# EAGLE design SerialOLED (EAGLE 7.2.0)
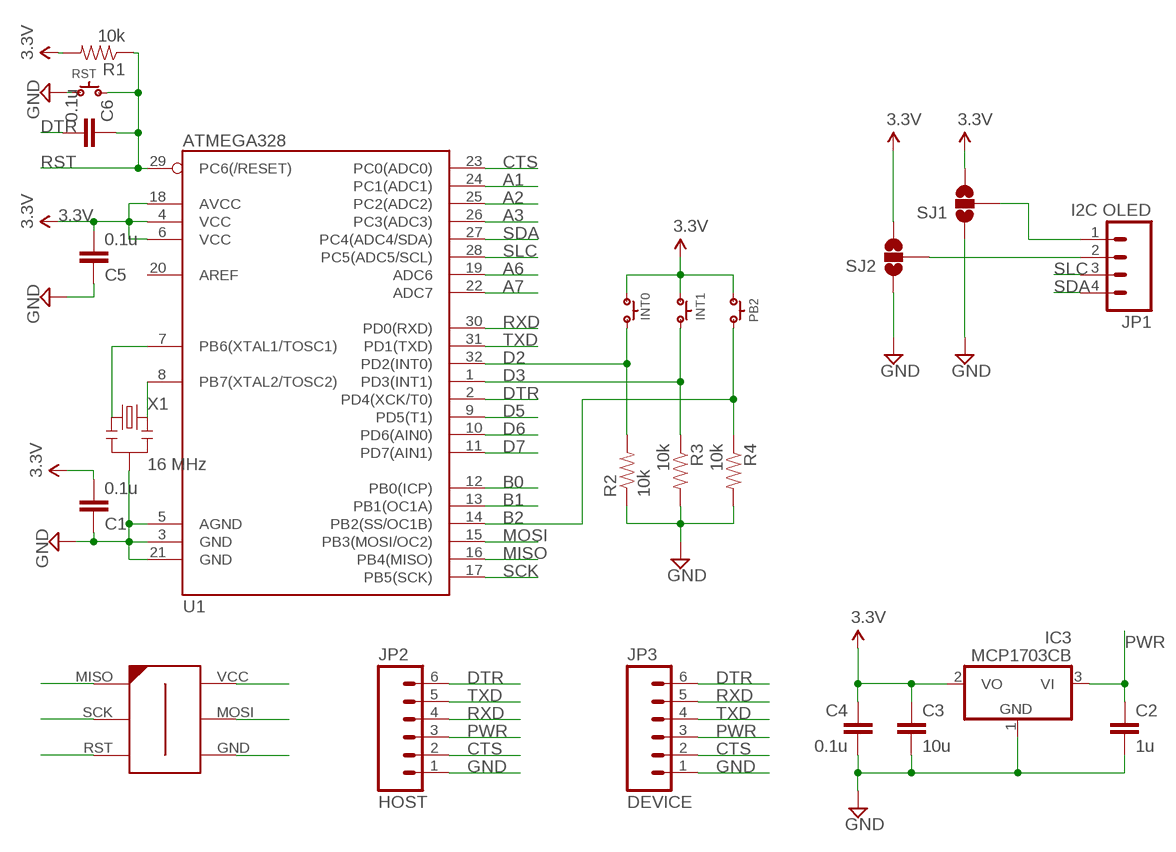
[diagram p0: schematic, sheet 1]

## Parts
C1  0.1u  CAP0603-CAP  [0603-CAP]
C2  1u  CAP0603-CAP  [0603-CAP]
C3  10u  CAP0805  [0805]
C4  0.1u  CAP0603-CAP  [0603-CAP]
C5  0.1u  CAP0603-CAP  [0603-CAP]
C6  0.1u  CAP0603-CAP  [0603-CAP]
IC3  MCP1703CB  [SOT23]
INT0  SPST.B3U-3000P(M)-B  [B3U-3000P(M)-B]
INT1  SPST.B3U-3000P(M)-B  [B3U-3000P(M)-B]
JP1  I2C OLED  M04LOCK  [1X04_LOCK]
JP2  HOST  M06SIP_LOCK  [1X06-SIP_LOCK]
JP3  DEVICE  M06SIP_LOCK  [1X06-SIP_LOCK]
PB2  SPST.B3U-3000P(M)-B  [B3U-3000P(M)-B]
R1  10k  RESISTOR0603-RES  [0603-RES]
R2  10k  RESISTOR0603-RES  [0603-RES]
R3  10k  RESISTOR0603-RES  [0603-RES]
R4  10k  RESISTOR0603-RES  [0603-RES]
RST  SPST.B3U-3000P(M)-B  [B3U-3000P(M)-B]
SJ1  SOLDERJUMPER_2WAYPASTE1&2  [SJ_3_PASTE1&2]
SJ2  SOLDERJUMPER_2WAYPASTE2&3  [SJ_3_PASTE2&3]
U1  ATMEGA328  ATMEGA168  [TQFP32-08]
U$6  AVR-ISP-6-EDGE  [6PAD_ISP]
X1  16 MHz  RESONATORSMD  [RESONATOR-SMD]

## Nets
3.3V [power]: C1.2 C3.1 C4.1 C5.2 IC3.2(VO) INT0.1 INT1.2 PB2.1 R1.2 SJ1.3 SJ2.3 U1.4(VCC) U1.6(VCC) U1.18(AVCC) U$6.VCC
A1: U1.24(PC1(ADC1))
A2: U1.25(PC2(ADC2))
A3: U1.26(PC3(ADC3))
A6: U1.19(ADC6)
A7: U1.22(ADC7)
B0: U1.12(PB0(ICP))
B1: U1.13(PB1(OC1A))
B2: PB2.2 R4.1 U1.14(PB2(SS/OC1B))
CTS: JP2.2 JP3.2 U1.23(PC0(ADC0))
D2: INT0.2 R2.2 U1.32(PD2(INT0))
D3: INT1.1 R3.1 U1.1(PD3(INT1))
D5: U1.9(PD5(T1))
D6: U1.10(PD6(AIN0))
D7: U1.11(PD7(AIN1))
DTR: C6.2 JP2.6 JP3.6 U1.2(PD4(XCK/T0))
GND [power]: C1.1 C2.2 C3.2 C4.2 C5.1 IC3.1(GND) JP2.1 JP3.1 R2.1 R3.2 R4.2 RST.1 SJ1.1 SJ2.1 U1.3(GND) U1.5(AGND) U1.21(GND) U$6.GND X1.2
MISO: U1.16(PB4(MISO)) U$6.MISO
MOSI: U1.15(PB3(MOSI/OC2)) U$6.MOSI
N$1: U1.7(PB6(XTAL1/TOSC1)) X1.1
N$2: JP1.2 SJ2.2
N$4: JP1.1 SJ1.2
N$21: U1.8(PB7(XTAL2/TOSC2)) X1.3
PWR [power]: C2.1 IC3.3(VI) JP2.3 JP3.3
RST: C6.1 R1.1 RST.2 U1.29(PC6(/RESET)) U$6.RST
RXD: JP2.4 JP3.5 U1.30(PD0(RXD))
SCK: U1.17(PB5(SCK)) U$6.SCK
SDA: JP1.4 U1.27(PC4(ADC4/SDA))
SLC: JP1.3 U1.28(PC5(ADC5/SCL))
TXD: JP2.5 JP3.4 U1.31(PD1(TXD))
Unconnected: U1.20(AREF)

## Library data of the parts
C1-C6 = SparkFun:CAP: Capacitor Standard 0603 ceramic capacitor, and 0.1" leaded capacitor.
IC3 = linear:MCP1703: 250 mA, 16V, Low Quiescent Current LDO Regulator Source: http://ww1.microchip.com/downloads/en/DeviceDoc/22049b.pdf
INT0 INT1 PB2 RST = omron:SPST
JP1 = SparkFun:M04: Header 4 Standard 4-pin 0.1" header. Use with straight break away headers (SKU : PRT-00116), right angle break away headers (PRT-00553), swiss pins (PRT-00743), machine pins (PRT-00117), and female headers (PRT-00115). Molex polarized connector foot print use with SKU : PRT-08231 with associated crimp pins and housings. 1MM SMD Version SKU: PRT-10208
JP2 JP3 = SparkFun:M06: Header 6 Standard 6-pin 0.1" header. Use with straight break away headers (SKU : PRT-00116), right angle break away headers (PRT-00553), swiss pins (PRT-00743), machine pins (PRT-00117), and female headers (PRT-00115). Molex polarized connector foot print use with SKU : PRT-08094 with associated crimp pins and housings. NOTES ON THE VARIANTS LOCK and LOCK_LONGPADS... This footprint was designed to help hold the alignment of a through-hole component (i.e. 6-pin header) while soldering it into place. You may notice that each hole has been shifted either up or down by 0.005 of an inch from it's more standard position (which is a perfectly straight line). This slight alteration caused the pins (the squares in the middle) to touch the edges of the holes. Because they are alternating, it causes a "brace" to hold the component in place. 0.005 has proven to be the perfect amount of "off-center" position when using our standard breakaway headers. Although looks a little odd when you look at the bare footprint, once you have a header in there, the alteration is very hard to notice. Also, if you push a header all the way into place, it is covered up entirely on the bottom side. This idea of altering the position of holes to aid alignment will be further integrated into the Sparkfun Library for other footprints. It can help hold any component with 3 or more connection pins.
R1-R4 = SparkFun:RESISTOR: Resistor Basic schematic elements and footprints for 0603, 1206, and PTH resistors.
SJ1 SJ2 = SparkFun:SOLDERJUMPER_2WAY: Solder Jumper 2 way solder jumper
U1 = SparkFun:ATMEGA168
U$6 = avr-7:AVR-ISP-6-EDGE: 6 pin edge connector for ISP with ATMEL MCUs. Developed by Craig Moates (craig at moates dot net). Library by David Blundell (blundar at gmail dot com). Often, even a 6 pin header is really inconvenient for board layout and/or production. This SMD-only header is our de-facto standard for using an edge connector for programming with the help of a 6pin/10pin to edge card adapter.
X1 = SparkFun:RESONATOR: Resonator Small SMD resonator. This is the itty bitty 10/20MHz resonators with built in caps. CSTCE10M0G55 and CSTCE20M0V53. Footprint has been reviewed closely but hasn't been tested yet.

## Net classes
0 default: width 0.203 mm, clearance 0.203 mm
1 power: width 0.381 mm, clearance 0.254 mm

## Board
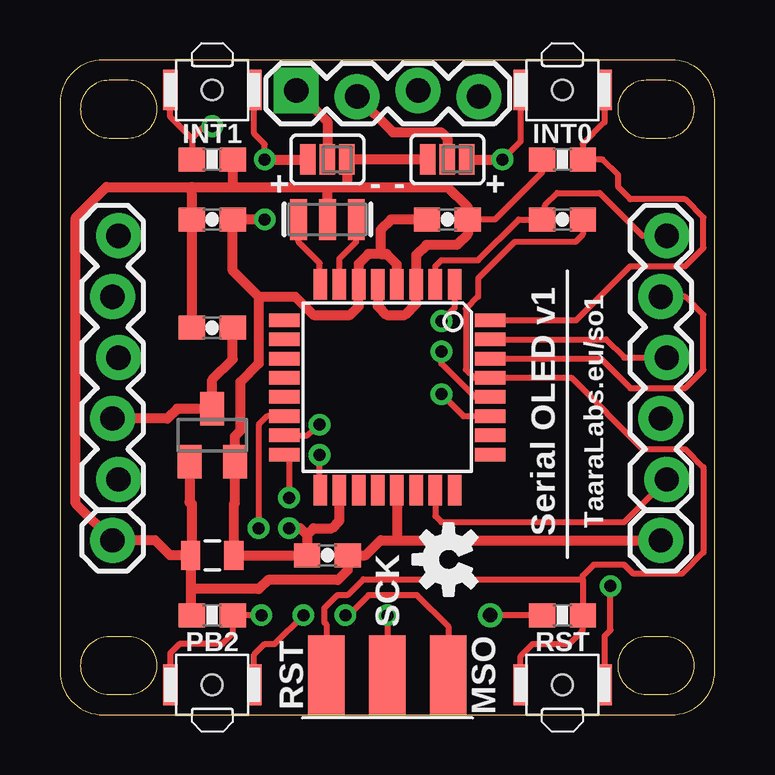
[diagram p1: board, top side]
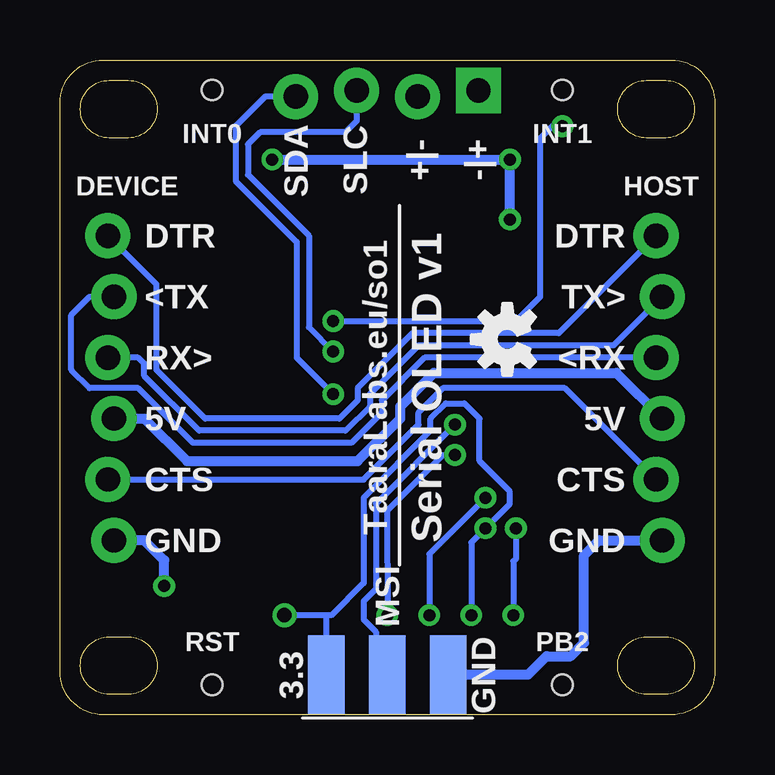
[diagram p2: board, bottom side, seen from below]

Size 27.3 x 27.3 mm. Coordinates in mm from the lower left corner, seen from the top.
Outline: 0,25.5 0,1.8 arc90 1.8,0 25.5,0 arc90 27.3,1.8 27.3,25.5 arc90 25.5,27.3 1.8,27.3 arc90 0,25.5
Outline: 0.85,25.25 arc90 2.05,24.05 2.85,24.05 arc90 4.05,25.25 arc90 2.85,26.45 2.05,26.45 arc90 0.85,25.25
Outline: 0.85,2.05 arc90 2.05,0.85 2.85,0.85 arc90 4.05,2.05 arc90 2.85,3.25 2.05,3.25 arc90 0.85,2.05
Outline: 23.25,2.05 arc90 24.45,0.85 25.25,0.85 arc90 26.45,2.05 arc90 25.25,3.25 24.45,3.25 arc90 23.25,2.05
Outline: 23.25,25.25 arc90 24.45,24.05 25.25,24.05 arc90 26.45,25.25 arc90 25.25,26.45 24.45,26.45 arc90 23.25,25.25
Copper layers (1*16): Top 0.035mm / dielectric 1.5mm / Bottom 0.035mm
Design rules "default": minimum track width 0.2mm, minimum drill 0.4mm, track to track 8mil, track to pad 8mil, pad to pad 8mil, via to via 8mil, smd to smd 8mil, copper to edge 12mil, drill to drill 0.4mm, minimum pad ring 0.3mm, minimum via ring 8mil, stop-mask expansion 4mil, vias tented up to drill 20mil, thermal gap 10mil

### Footprints (pad centres in the part's own frame; a part is rotated, then mirrored left to right if it is on the bottom)
0603-CAP = smd 1.1 x 1: 1 -0.85,0; 2 0.85,0
0805 = smd 0.8 x 1.2: 1 -0.9,0; 2 0.9,0
SOT23 = smd 1 x 1.4: 1 -0.95,-1.1; 2 0.95,-1.1; 3 0,1.1
B3U-3000P(M)-B = smd 0.6 x 1.7: 1 -1.75,0; 2 1.75,0 | hole 0.85: 0,0
1X04_LOCK = drill 1.016 pad 1.88 square: 1 0,0.127 | drill 1.016 pad 1.88: 2 2.54,-0.127; 3 5.08,0.127; 4 7.62,-0.127
1X06-SIP_LOCK = drill 1.016 pad 1.88: 1 0,0; 2 2.54,-0.254; 3 5.08,0; 4 7.62,-0.254; 5 10.16,0; 6 12.7,-0.254
0603-RES = smd 1.1 x 1: 1 -0.85,0; 2 0.85,0
SJ_3_PASTE1&2 = smd 0.635 x 1.27: 1 -0.813,0; 2 0,0; 3 0.813,0
SJ_3_PASTE2&3 = smd 0.635 x 1.27: 1 -0.813,0; 2 0,0; 3 0.813,0
TQFP32-08 = smd 1.27 x 0.559: 1 -4.293,2.8; 2 -4.293,2; 3 -4.293,1.2; 4 -4.293,0.4; 5 -4.293,-0.4; 6 -4.293,-1.2; 7 -4.293,-2; 8 -4.293,-2.8; 17 4.293,-2.8; 18 4.293,-2; 19 4.293,-1.2; 20 4.293,-0.4; 21 4.293,0.4; 22 4.293,1.2; 23 4.293,2; 24 4.293,2.8 | smd 0.559 x 1.27: 9 -2.8,-4.293; 10 -2,-4.293; 11 -1.2,-4.293; 12 -0.4,-4.293; 13 0.4,-4.293; 14 1.2,-4.293; 15 2,-4.293; 16 2.8,-4.293; 25 2.8,4.293; 26 2,4.293; 27 1.2,4.293; 28 0.4,4.293; 29 -0.4,4.293; 30 -1.2,4.293; 31 -2,4.293; 32 -2.8,4.293
6PAD_ISP = smd 1.524 x 3.302 bottom: GND 2.54,0; MOSI 0,0; VCC -2.54,0 | smd 1.524 x 3.302: MISO -2.54,0; RST 2.54,0; SCK 0,0
RESONATOR-SMD = smd 0.7 x 1.7: 1 -1.2,0; 2 0,0; 3 1.2,0

### Placement (x,y rotation side)
C1  11.15,6.65 180 top
C2  6.35,16.13 180 top
C3  6.35,6.65 180 top
C4  6.35,20.65 180 top
C5  16.15,20.65 180 top
C6  20.95,20.65 180 top
IC3  6.35,11.65 0 top
INT0  20.95,26.05 0 top
INT1  6.35,26.05 0 top
JP1  9.85,25.9 0 top
JP2  2.19,7.27 90 top
JP3  25.05,7.27 90 top
PB2  6.35,1.25 180 top
R1  20.95,4.15 180 top
R2  20.95,23.15 0 top
R3  6.35,23.15 0 top
R4  6.35,4.15 180 top
RST  20.95,1.25 180 top
SJ1  11.15,23.15 180 top
SJ2  16.15,23.15 0 top
U1  13.65,13.65 270 top
U$1  [OSHW-LOGO-S]  16.2,6.48 90 top
U$2  [OSHW-LOGO-S]  8.65,15.65 90 bottom
U$6  13.65,1.65 180 top
X1  11.15,20.65 180 top

### Tracks (layer width: path | path; a pad name or v marks a point on that pad's centre or on a via)
3.3V  (via drill 0.5, 0.5 pad 0.25, 0.6)
  Top 0.254: v8.54,23.15 8.54,23.78 8.1,24.22 INT1.2 | INT0.1 19.2,23.9 v18.45,23.15 | PB2.1 8.1,2.51 8.54,2.95 8.95,2.95 v10.15,4.15 | R1.2 v17.94,4.15
  Top 0.406: U1.18 11.65,8.09 11.33,7.78 10.57,7.78 10.3,7.51 | 8.29,17.43 7.2,18.52 C4.1 | 8.29,17.43 8.29,14.64 7.52,13.87 7.52,11.84 7.3,11.62 IC3.2 7.3,8.82 7.25,8.77 C3.1 C1.2 10.3,7.51 | 8.29,17.43 9.81,17.43 10.57,16.67 12.1,16.67 12.45,17.02 U1.6 12.45,18.8 12.86,19.21 13.37,19.21 | U1.4 14.05,18.78 13.62,19.21 13.37,19.21 | C5.2 13.79,20.65 13.37,20.22 13.37,19.21 | 7.28,20.73 C4.1 | v8.54,20.65 C4.1 | v8.54,23.15 SJ1.3 | SJ2.3 v18.45,23.15 | v9.56,7.78 10.03,7.78 10.3,7.51
  Bottom 0.254: v10.15,4.15 10.15,7.18 v9.56,7.78 8.54,8.79 8.54,9.3 9.81,10.57 9.81,12.35 10.45,12.99 11.21,12.99 11.84,12.35 11.84,11.84 14.64,9.05 14.64,5.49 15.98,4.15 16.25,4.15 | 16.25,4.15 v17.94,4.15 | U$6.VCC 16.19,4.09 16.25,4.15
  Bottom 0.406: v8.54,20.65 v8.54,23.15 v18.45,23.15
B2  (via drill 0.5 pad 0.25)
  Top 0.254: PB2.2 4.6,2.57 4.98,2.95 6.76,2.95 7.2,3.39 R4.1 v8.4,4.15 | U1.14 8.64,12.45 8.29,12.1 v8.29,7.78
  Bottom 0.254: v8.29,7.78 8.29,6.51 8.4,6.4 v8.4,4.15
CTS
  Top 0.254: U1.23 15.65,8.29 15.91,8.03 23.53,8.03 JP3.2
  Bottom 0.254: JP2.2 6.25,13.62 11.33,13.62 12.35,12.6 12.35,12.1 14.64,9.81 JP3.2
D2
  Top 0.254: U1.32 21.53,16.45 23.78,18.7 26.07,18.7 26.83,19.46 26.83,20.73 26.07,21.49 23.78,21.49 23.27,22 23.27,22.51 22.63,23.15 R2.2 | 22,23.02 R2.2 | INT0.2 22.7,24.7 21.8,23.8 R2.2
D3  (via drill 0.5, 0.5 pad 0.25)
  Top 0.254: 5.5,24.03 4.6,24.93 INT1.1 | U1.1 16.45,16.96 v15.91,16.41 | v6.35,24.54 6,24.54 5.5,24.04 5.5,24.03 | 5.5,24.03 R3.1
  Bottom 0.254: v15.91,16.41 8.29,16.41 7.27,17.43 7.27,24.03 6.76,24.54 v6.35,24.54
DTR
  Top 0.254: U1.2 15.65,18.7 15.91,18.95 17.43,18.95 19.13,20.65 C6.2 20.22,20.77 20.22,21.24 20.73,21.75 22.51,21.75 24.29,19.97 JP3.6
  Bottom 0.254: JP2.6 6.51,15.91 12.6,15.91 14.89,13.62 14.89,13.11 15.65,12.35 21.24,12.35 23.27,14.38 23.27,17.94 JP3.6
GND  (via drill 0.5 pad 0.25)
  Top 0.254: v22.95,5.37 22.95,3.52 22.7,3.27 RST.1 | R2.1 20.1,22.61 18.14,20.65 C5.1
  Top 0.406: IC3.1 5.4,8.89 arc90 5.49,8.79 5.49,6.69 arc-90 C3.2 | C2.2 C4.2 5.5,21.5 5.49,22 | C3.2 4.59,6.65 3.97,7.27 JP2.1 0.67,8.79 0.67,20.73 1.94,22 5.49,22 | U1.5 13.25,17.04 13.62,16.67 14.38,16.67 14.85,17.14 U1.3 14.85,19.17 15.27,19.59 16.54,19.59 17,20.05 C5.1 17,21.16 16.16,22 12.1,22 | SJ2.1 SJ1.1 11.96,22.13 12.1,22 | 5.49,22 7.2,22 | 7.2,22 11.15,22 | 11.15,22 12.1,22 | R3.2 7.2,22 | C3.2 5.45,5.24 | 5.45,5.24 5.45,4.2 R4.2 | 5.45,5.24 8.29,5.24 8.67,5.62 11.59,5.62 12,6.03 C1.1 12.75,6.65 13.37,7.27 14.13,7.27 | 14.13,7.27 JP3.1 | U1.21 14.05,7.35 14.13,7.27 | X1.2 11.15,22
  Bottom 0.406: v22.95,5.37 22.95,6.44 23.78,7.27 JP3.1 | U$6.GND 11.08,1.68 7.78,1.68 7.02,2.44 6,2.44 5.45,2.99 C3.2 4.83,7.27 JP2.1
MISO  (via drill 0.5 pad 0.25)
  Top 0.254: U1.16 9.56,10.65 v9.56,9.05 | v11.9,4.15 12.02,4.15 12.86,4.98 14.89,4.98 16.19,3.68 U$6.MISO
  Bottom 0.254: v9.56,9.05 11.9,6.7 v11.9,4.15
MOSI  (via drill 0.5 pad 0.25)
  Top 0.254: U1.15 10.32,11.65 v10.83,12.1
  Bottom 0.254: v10.83,12.1 14.13,8.79 14.13,5.24 14.64,4.73 14.64,3.97 14.13,3.46 14.13,2.13 U$6.MOSI
N$1
  Top 0.254: U1.7 11.65,19.02 12.35,19.72 X1.1
N$2
  Top 0.406: JP1.2 13.88,24.29 15.91,24.29 16.15,24.04 SJ2.2
N$4
  Top 0.406: JP1.1 11.15,24.73 SJ1.2
N$21
  Top 0.254: U1.8 10.83,17.97 10.83,18.83 9.95,19.7 X1.3
PWR
  Top 0.406: JP2.3 4.48,12.35 4.88,12.75 IC3.3 6.35,13.97 7.2,14.82 C2.1
  Bottom 0.406: JP3.3 23.78,12.35 22,10.57 14.89,10.57 13.11,12.35 13.11,12.86 11.71,14.26 4.1,14.26 JP2.3
RST
  Top 0.254: RST.2 19.2,2.44 19.72,2.95 21.24,2.95 21.8,3.51 R1.1 21.8,5.65 | C6.1 21.8,20.02 21.49,19.72 18.95,19.72 17.43,18.19 17.43,17.43 16.92,16.92 16.92,14.38 17.25,14.05 U1.29 21.32,14.05 24.29,11.08 26.07,11.08 26.83,10.32 26.83,6.76 25.94,5.87 23.91,5.87 23.53,6.25 22.26,6.25 21.8,5.8 21.8,5.65 | U$6.RST 11.11,3.77 11.03,3.85 11.03,4.45 11.56,4.98 11.98,4.98 12.65,5.65 21.8,5.65
RXD
  Top 0.254: U1.30 22.55,14.85 23.78,13.62 26.07,13.62 26.83,14.38 26.83,16.67 26.07,17.43 JP3.5
  Bottom 0.254: JP2.4 12.1,14.89 13.87,13.11 13.87,12.6 15.14,11.33 21.75,11.33 24.03,13.62 26.07,13.62 26.83,14.38 26.83,16.67 26.07,17.43 JP3.5
SCK  (via drill 0.5 pad 0.25)
  Top 0.254: U1.17 10.83,9.38 v10.83,10.83 | v13.65,4.15 U$6.SCK
  Bottom 0.254: v10.83,10.83 11.33,10.83 13.66,8.5 v13.65,4.15
SDA  (via drill 0.5 pad 0.25)
  Top 0.254: U1.27 16.82,12.45 v15.91,13.37
  Bottom 0.254: JP1.4 18.74,25.77 19.97,24.54 19.97,22.26 17.43,19.72 17.43,14.89 v15.91,13.37
SLC  (via drill 0.5 pad 0.25)
  Top 0.254: U1.28 17.29,13.25 15.91,14.64 v15.91,15.14
  Bottom 0.254: JP1.3 14.93,24.76 15.4,24.29 18.95,24.29 19.46,23.78 19.46,22.51 16.92,19.97 16.92,16.16 v15.91,15.14
TXD
  Top 0.254: U1.31 22.77,15.65 23.53,14.89 JP3.4
  Bottom 0.254: JP2.5 4.22,15.4 12.35,15.4 14.38,13.37 14.38,12.86 15.4,11.84 21.49,11.84 23.78,14.13 23.78,14.64 24.03,14.89 JP3.4

### Text on the board
tNames: + | - | - | + | Serial OLED v1 | TaaraLabs.eu/so1 | SCK | RST | MSO
bNames: INT1 | INT0 | -|+ | +|- | SLC | SDA | HOST | DEVICE | DTR | DTR | TX> | <TX | <RX | RX> | 5V | 5V | CTS | CTS | GND | GND | MSI | PB2 | RST | GND | 3.3
_bsilk: Serial OLED v1 | TaaraLabs.eu/so1